# EAGLE design 2channelrelaydriver_throughole (EAGLE 7.2.0)
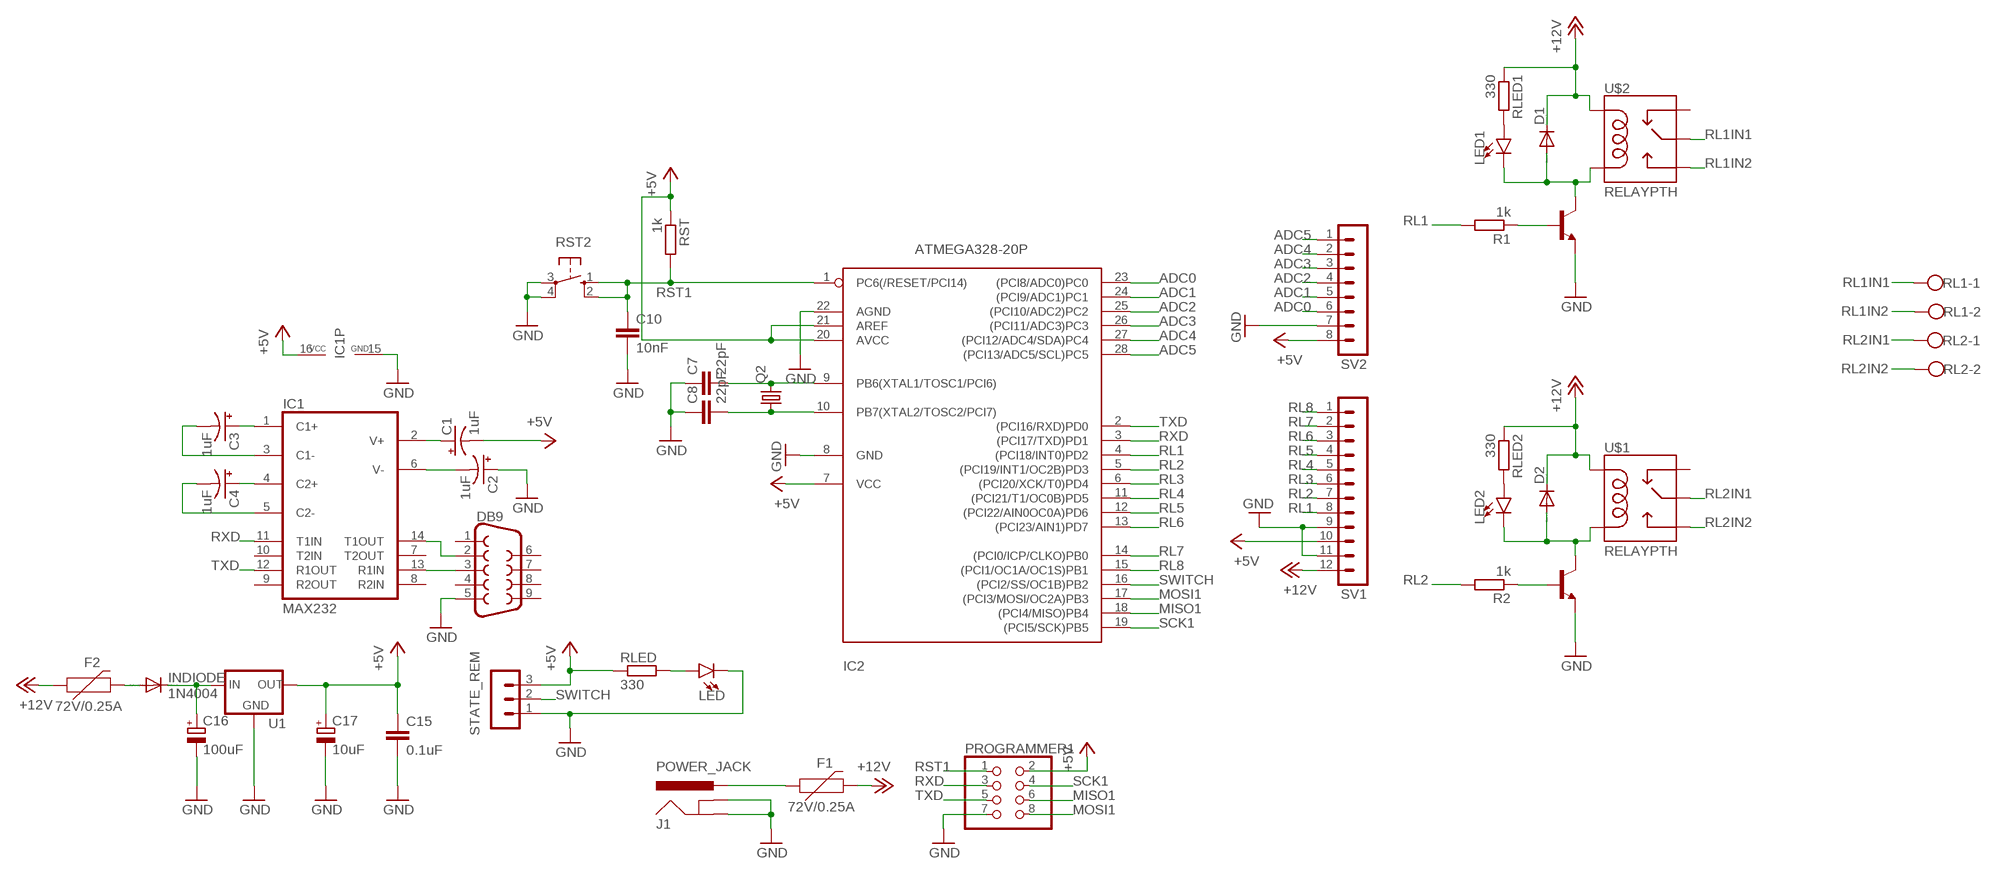
[diagram p0: schematic, sheet 1]

## Parts
C1  1uF  CPOL-USE2.5-6  [E2,5-6]
C2  1uF  CPOL-USE2.5-6  [E2,5-6]
C3  1uF  CPOL-USE2.5-6  [E2,5-6]
C4  1uF  CPOL-USE2.5-6  [E2,5-6]
C7  22pF  C-EU025-025X050  [C025-025X050]
C8  22pF  C-EU025-025X050  [C025-025X050]
C10  10nF  C-EU050-025X075  [C050-025X075]
C15  0.1uF  C-EU050-025X075  [C050-025X075]
C16  100uF  CPOL-EUE2.5-6  [E2,5-6]
C17  10uF  CPOL-EUE2.5-6  [E2,5-6]
D1  1N4004  [DO41-10]
D2  1N4004  [DO41-10]
DB9  DB9FEMALE  [DB9]
F1  72V/0.25A  PPTC_PTH  [PTH]
F2  72V/0.25A  PPTC_PTH  [PTH]
IC1  MAX232  [DIL16]
IC2  ATMEGA328-20P  [DIL28-3]
INDIODE  1N4004  [DO41-10]
J1  POWER_JACK  [POWER_JACK_PTH]
LED  LED5MM  [LED_5MM]
LED1  LED5MM  [LED_5MM]
LED2  LED5MM  [LED_5MM]
PROGRAMMER1  PINHD-2X4  [2X04]
Q2  CRYSTALHC49U70  [HC49U70]
R1  1k  R-EU_0207/10  [0207/10]
R2  1k  R-EU_0207/10  [0207/10]
RL1  W237-102  [W237-102]
RL2  W237-102  [W237-102]
RLED  330  R-EU_0207/10  [0207/10]
RLED1  330  R-EU_0207/10  [0207/10]
RLED2  330  R-EU_0207/10  [0207/10]
RST  1k  R-EU_0207/10  [0207/10]
RST2  10-XX  [B3F-10XX]
STATE_REM  MA03-1  [MA03-1]
SV1  MA12-1  [MA12-1]
SV2  MA08-1  [MA08-1]
T1  BC547  [TO92]
T2  BC547  [TO92]
U1  V_REG_78XXSIDE  [78XXL]
U$1  RELAYPTH  [SRD-05VDC-SL-C]
U$2  RELAYPTH  [SRD-05VDC-SL-C]

## Nets
+12V: D1.C D2.C F1.P$2 F2.P$1 RLED1.1 RLED2.1 SV1.12 U$1.COIL1 U$2.COIL1
ADC0: IC2.23((PCI8/ADC0)PC0) SV2.6
ADC1: IC2.24((PCI9/ADC1)PC1) SV2.5
ADC2: IC2.25((PCI10/ADC2)PC2) SV2.4
ADC3: IC2.26((PCI11/ADC3)PC3) SV2.3
ADC4: IC2.27((PCI12/ADC4/SDA)PC4) SV2.2
ADC5: IC2.28((PCI13/ADC5/SCL)PC5) SV2.1
MISO1: IC2.18((PCI4/MISO)PB4) PROGRAMMER1.6
MOSI1: IC2.17((PCI3/MOSI/OC2A)PB3) PROGRAMMER1.8
N$1: DB9.2 IC1.14(T1OUT)
N$2: LED.A RLED.2
N$3: C16.+ INDIODE.C U1.IN
N$4: D2.A LED2.K(C) T2.3(C) U$1.COIL0
N$5: D1.A LED1.K(C) T1.3(C) U$2.COIL0
N$6: R1.1 T1.2(B)
N$7: R2.1 T2.2(B)
N$8: F1.P$1 J1.PWR
N$9: LED1.A RLED1.2
N$10: LED2.A RLED2.2
N$11: F2.P$2 INDIODE.A
N$18: C1.+ IC1.2(V+)
N$20: C2.- IC1.6(V-)
N$21: C7.2 IC2.9(PB6(XTAL1/TOSC1/PCI6)) Q2.2
N$22: C8.2 IC2.10(PB7(XTAL2/TOSC2/PCI7)) Q2.1
N$23: C3.+ IC1.1(C1+)
N$24: C4.+ IC1.4(C2+)
N$25: C4.- IC1.5(C2-)
N$26: C3.- IC1.3(C1-)
PIN13: DB9.3 IC1.13(R1IN)
RL1: IC2.4((PCI18/INT0)PD2) R1.2 SV1.8
RL1IN1: RL1.1 U$2.SWCOMMON
RL1IN2: RL1.2 U$2.SWOPEN
RL2: IC2.5((PCI19/INT1/OC2B)PD3) R2.2 SV1.7
RL2IN1: RL2.1 U$1.SWCOMMON
RL2IN2: RL2.2 U$1.SWOPEN
RL3: IC2.6((PCI20/XCK/T0)PD4) SV1.6
RL4: IC2.11((PCI21/T1/OC0B)PD5) SV1.5
RL5: IC2.12((PCI22/AIN0OC0A)PD6) SV1.4
RL6: IC2.13((PCI23/AIN1)PD7) SV1.3
RL7: IC2.14((PCI0/ICP/CLKO)PB0) SV1.2
RL8: IC2.15((PCI1/OC1A/OC1S)PB1) SV1.1
RST1: C10.1 IC2.1(PC6(/RESET/PCI14)) PROGRAMMER1.1 RST2.1(S) RST2.2(S1) RST.2
RXD: IC1.11(T1IN) IC2.3((PCI17/TXD)PD1) PROGRAMMER1.3
SCK1: IC2.19((PCI5/SCK)PB5) PROGRAMMER1.4
SWITCH: IC2.16((PCI2/SS/OC1B)PB2) STATE_REM.2
TXD: IC1.12(R1OUT) IC2.2((PCI16/RXD)PD0) PROGRAMMER1.5
VDD: C1.- C15.1 C17.+ IC1.16(VCC) IC2.7(VCC) IC2.20(AVCC) IC2.21(AREF) PROGRAMMER1.2 RLED.1 RST.1 STATE_REM.3 SV1.10 SV2.8 U1.OUT ; supply symbol labelled +5V
VSS: C2.+ C7.1 C8.1 C10.2 C15.2 C16.- C17.- DB9.5 IC1.15(GND) IC2.8(GND) IC2.22(AGND) J1.GND J1.GNDBREAK LED.K(C) PROGRAMMER1.7 RST2.3(P) RST2.4(P1) STATE_REM.1 SV1.9 SV1.11 SV2.7 T1.1(E) T2.1(E) U1.GND ; supply symbol labelled GND
Unconnected: DB9.1 DB9.4 DB9.6 DB9.7 DB9.8 DB9.9 IC1.7(T2OUT) IC1.8(R2IN) IC1.9(R2OUT) IC1.10(T2IN) U$1.SWCLOSED(SWCLOSE) U$2.SWCLOSED(SWCLOSE)

## Library data of the parts
C1-C4 = rcl:CPOL-US: POLARIZED CAPACITOR, American symbol
C7 C8 C10 C15 = rcl:C-EU: CAPACITOR, European symbol
C16 C17 = rcl:CPOL-EU: POLARIZED CAPACITOR, European symbol
D1 D2 INDIODE = diode:1N4004: DIODE general purpose rectifier, 1 A
DB9 = SparkFun-Connectors:DB9: DB9 Connector Standard DB9 (D-Sub 9) serial connector. Can be used for CAN bus as well as RS485 and RS232. Footprint production proven. Here is the female version connector we sell at SparkFun: 9 Pin Female Serial Connector - PCB Mount <https://www.sparkfun.com/products/429> (PRT-00429) This connector has been used on the following SparkFun products: SparkFun RS232 Shifter - SMD <https://www.sparkfun.com/products/449> (PRT-00449) SparkFun RS232 Shifter SMD (No DB9) <https://www.sparkfun.com/products/8780> (PRT-08780); PROD_ID: CONN-08194
F1 F2 = SparkFun-Fuses:PPTC: Resettable Fuse PPTC Resettable Fuse. Really a sort of resistor with a polymeric positive temperature coefficient whose resistance increases dramatically with an increase in temperature. When heated by the power passing through the resistance rises causing the current to be limited, protecting the circuit. This is achieved by the transition of the polymer from a crystalline to an amorphous state where the conductive carbon separates breaking the conductive pathways found in the cool crystalline structure. When a PPTC cools back down it resumes conducting letting the circuit turn back on. SparkFun Products: SparkFun RedBoard - Programmed with Arduino <https://www.sparkfun.com/products/12757> Pro Micro - 5V/16MHz <https://www.sparkfun.com/products/12640> Arduino Pro 328 - 5V/16MHz <https://www.sparkfun.com/products/10915> MP3 Trigger <https://www.sparkfun.com/products/13720>; PROD_ID: RES-08490
IC1 = maxim:MAX232: RS232 TRANSCEIVER; MF: MAXIM; MPN: MAX232ACPE+; OC_FARNELL: 9723773; OC_NEWARK: 68K4544
IC2 = atmega328:ATMEGA328*P: MICROCONTROLLER 32 kBytes FLASH 2 kBytes SRAM 1 kBytes EEPROM USART 8-channel 10 bit ADC
J1 = SparkFun-Connectors:POWER_JACK: Power Jack Connector This is the standard 5.5mm barrel jack for power. The PTH is the most common, proven, reliable, footprint. The Slot footprint only works if the mill layer is transmitted to the PCB fab house so be warned. Here are the connectors we sell at SparkFun: DC Barrel Power Jack/Connector <https://www.sparkfun.com/products/119> (PRT-00119) DC Barrel Power Jack/Connector (SMD) <https://www.sparkfun.com/products/12748> (PRT-12748) DC Barrel Jack Adapter - Breadboard Compatible <https://www.sparkfun.com/products/10811> (PRT-10811) It is used on this SparkFun product (and many, many others): SparkFun RedBoard - Programmed with Arduino <https://www.sparkfun.com/products/12757> (DEV-12757) Also, if you need a mating power supply or connector, please check these out: Wall Adapter Power Supply - 9VDC 650mA <https://www.sparkfun.com/products/298> (TOL-00298) DC Barrel Jack Adapter - Male <https://www.sparkfun.com/products/10287> (PRT-10287); PROD_ID: CONN-08197
LED LED1 LED2 = SparkFun-LED:LED: LED (Generic) Standard schematic elements and footprints for 5mm, 3mm, 1206, and 0603 sized LEDs. Generic LEDs with no color specified.
PROGRAMMER1 = pinhead:PINHD-2X4: PIN HEADER
Q2 = crystal:CRYSTAL: CRYSTAL; OC_FARNELL: unknown; OC_NEWARK: unknown
R1 R2 RLED RLED1 RLED2 RST = resistor:R-EU_: RESISTOR, European symbol
RL1 RL2 = con-wago-500:W237-102: WAGO SCREW CLAMP; MPN: 237-102; OC_FARNELL: unknown; OC_NEWARK: 70K9898
RST2 = switch-omron:10-XX: OMRON SWITCH; MPN: B3F-1000; OC_FARNELL: 176432; OC_NEWARK: 36M3542
STATE_REM = con-lstb:MA03-1: PIN HEADER; OC_FARNELL: unknown; OC_NEWARK: unknown
SV1 = con-lstb:MA12-1: PIN HEADER; OC_FARNELL: unknown; OC_NEWARK: unknown
SV2 = con-lstb:MA08-1: PIN HEADER; OC_FARNELL: unknown; OC_NEWARK: unknown
T1 T2 = transistor-neu-to92:BC547: NPN TRANSISTOR
U1 = SparkFun-IC-Power:V_REG_78XX: Voltage Regulator Standard 78xx regulator. IGO (Input Ground Output). Spark Fun Electronics SKU : COM-00107
U$1 U$2 = SRD-05VDC-SL-C:RELAY: SPDT relay (COM-00101)

## Board
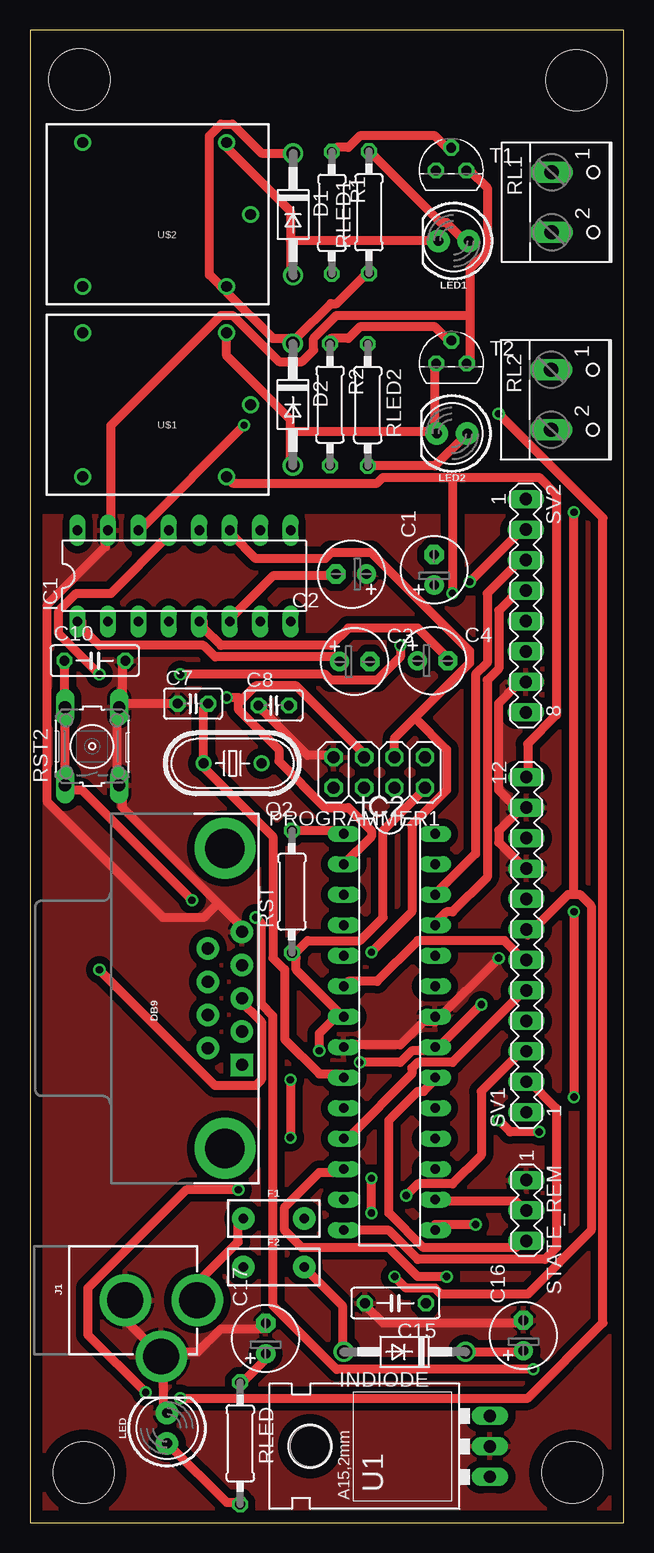
[diagram p1: board, top side]
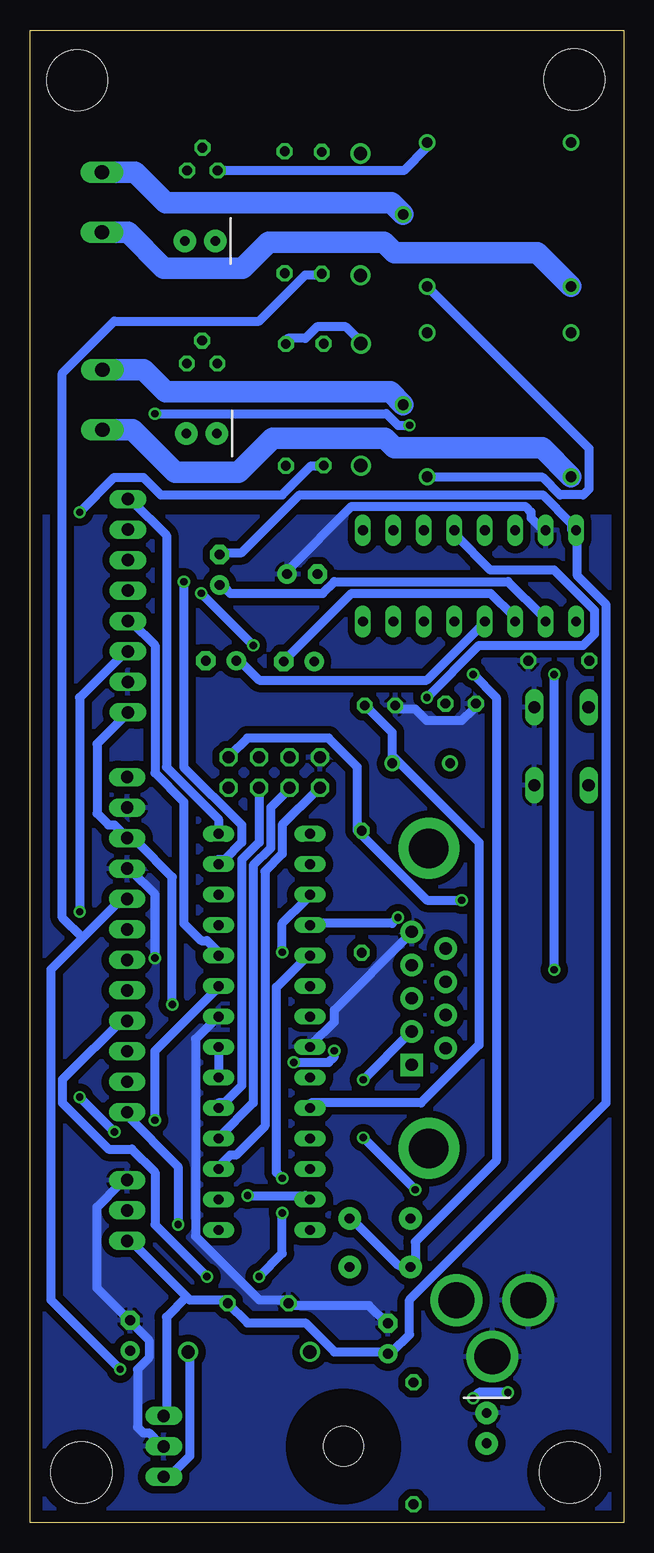
[diagram p2: board, bottom side, seen from below]

Size 49.51 x 124.38 mm. Coordinates in mm from the lower left corner, seen from the top.
Outline: 0,0 49.51,0 49.51,124.38 0,124.38 0,0
Copper layers (1*16): Top 0.035mm / dielectric 1.5mm / Bottom 0.035mm
Design rules "default *": minimum track width 30mil, minimum drill 24mil, track to track 8mil, track to pad 8mil, pad to pad 8mil, via to via 8mil, smd to smd 8mil, copper to edge 40mil, drill to drill 8mil, minimum pad ring 10mil, minimum via ring 8mil, stop-mask expansion 4mil, vias tented up to drill 0mil, thermal gap 10mil
Holes 5.08 mm at 4.12,120.25 45.57,120.2 45.22,4.18 4.48,4.18

### Footprints (pad centres in the part's own frame; a part is rotated, then mirrored left to right if it is on the bottom)
E2,5-6 = drill 0.813 pad 1.6: + -1.27,0 | drill 0.813 pad 1.6 octagon: - 1.27,0
C025-025X050 = drill 0.813 octagon: 1 -1.27,0; 2 1.27,0
C050-025X075 = drill 0.813 octagon: 1 -2.54,0; 2 2.54,0
DO41-10 = drill 1.118: A 5.08,0; C -5.08,0
DB9 = drill 1.016 pad 1.88 square: 1 -5.54,-1.42 | drill 1.016 pad 1.88: 2 -2.77,-1.42; 3 0,-1.42; 4 2.77,-1.42; 5 5.54,-1.42; 6 -4.15,1.42; 7 -1.38,1.42; 8 1.38,1.42; 9 4.15,1.42 | drill 3.302 pad 5.08: G1 -12.5,0; G2 12.5,0
PTH = drill 0.8 pad 1.88: P$1 -2.54,0; P$2 2.54,0
DIL16 = drill 0.813 long: 1 -8.89,-3.81; 2 -6.35,-3.81; 3 -3.81,-3.81; 4 -1.27,-3.81; 5 1.27,-3.81; 6 3.81,-3.81; 7 6.35,-3.81; 8 8.89,-3.81; 9 8.89,3.81; 10 6.35,3.81; 11 3.81,3.81; 12 1.27,3.81; 13 -1.27,3.81; 14 -3.81,3.81; 15 -6.35,3.81; 16 -8.89,3.81
DIL28-3 = drill 0.813 long: 1 -16.51,-3.81; 2 -13.97,-3.81; 3 -11.43,-3.81; 4 -8.89,-3.81; 5 -6.35,-3.81; 6 -3.81,-3.81; 7 -1.27,-3.81; 8 1.27,-3.81; 9 3.81,-3.81; 10 6.35,-3.81; 11 8.89,-3.81; 12 11.43,-3.81; 13 13.97,-3.81; 14 16.51,-3.81; 15 16.51,3.81; 16 13.97,3.81; 17 11.43,3.81; 18 8.89,3.81; 19 6.35,3.81; 20 3.81,3.81; 21 1.27,3.81; 22 -1.27,3.81; 23 -3.81,3.81; 24 -6.35,3.81; 25 -8.89,3.81; 26 -11.43,3.81; 27 -13.97,3.81; 28 -16.51,3.81
POWER_JACK_PTH = drill 2.997 pad 4.318: GND 0,7.7; GNDBREAK 4.7,10.7; PWR 0,13.7
LED_5MM = drill 0.813 pad 1.88: A -1.27,0; K 1.27,0
2X04 = drill 1.016 octagon: 1 -3.81,-1.27; 2 -3.81,1.27; 3 -1.27,-1.27; 4 -1.27,1.27; 5 1.27,-1.27; 6 1.27,1.27; 7 3.81,-1.27; 8 3.81,1.27
HC49U70 = drill 0.813: 1 -2.413,0; 2 2.413,0
0207/10 = drill 0.813 octagon: 1 -5.08,0; 2 5.08,0
W237-102 = drill 1.194 long: 1 -2.5,-1.27; 2 2.5,-1.27
B3F-10XX = drill 1.016 long: 1 -3.251,2.261; 2 3.251,2.261; 3 -3.251,-2.261; 4 3.251,-2.261
MA03-1 = drill 1.016 long: 1 -2.54,0; 2 0,0; 3 2.54,0
MA12-1 = drill 1.016 long: 1 -13.97,0; 2 -11.43,0; 3 -8.89,0; 4 -6.35,0; 5 -3.81,0; 6 -1.27,0; 7 1.27,0; 8 3.81,0; 9 6.35,0; 10 8.89,0; 11 11.43,0; 12 13.97,0
MA08-1 = drill 1.016 long: 1 -8.89,0; 2 -6.35,0; 3 -3.81,0; 4 -1.27,0; 5 1.27,0; 6 3.81,0; 7 6.35,0; 8 8.89,0
TO92 = drill 0.813 octagon: 1 1.27,0; 2 0,1.905; 3 -1.27,0
78XXL = drill 1.016 long: GND 0,-3.81; IN -2.54,-3.81; OUT 2.54,-3.81 | hole 3.302: 0,11.176
SRD-05VDC-SL-C = drill 0.9: COIL0 -5.39,-6.12; COIL1 -5.39,5.88; SWCLOSED 6.61,-6.12; SWCOMMON -7.39,-0.12; SWOPEN 6.61,5.88

### Placement (x,y rotation side)
C1  33.71,79.4 90 top
C2  26.8,79.04 180 top
C3  27.08,71.75 0 top
C4  33.58,71.83 0 top
C7  13.59,68.25 0 top
C8  20.32,68.1 0 top
C10  5.41,71.83 0 top
C15  30.48,18.29 180 top
C16  41.15,15.6 90 top
C17  19.66,15.34 90 top
D1  21.95,109.02 270 top
D2  21.92,93.17 270 top
DB9  16.26,43.69 90 top
F1  20.32,25.35 0 top
F2  20.32,21.29 0 top
IC1  12.85,78.89 0 top
IC2  29.97,40.89 270 top
INDIODE  31.24,14.22 180 top
J1  0.25,18.54 270 top
LED  11.43,7.87 90 top
LED1  35.33,106.81 180 top
LED2  35.2,90.75 180 top
PROGRAMMER1  29.13,62.51 180 top
Q2  16.89,63.27 180 top
R1  25.17,109.14 270 top
R2  25.02,93.17 270 top
RL1  44.78,110.03 270 top
RL2  44.73,93.57 270 top
RLED  17.53,6.6 270 top
RLED1  28.27,109.19 90 top
RLED2  28.17,93.14 270 top
RST  21.84,52.58 90 top
RST2  5.18,64.69 90 top
STATE_REM  41.4,26.01 270 top
SV1  41.4,48.16 90 top
SV2  41.35,76.4 270 top
T1  35.13,112.67 0 top
T2  35.15,96.6 0 top
U1  34.54,6.35 90 top
U$1  11,93.04 180 top
U$2  11,108.89 180 top

### Tracks (layer width: path | path; a pad name or v marks a point on that pad's centre or on a via)
+12V  (via drill 0.61)
  Top 0.762: RLED1.1 27.99,103.99 25.58,101.58 25.09,101.58 22.2,98.68 D2.C 21.72,98.68 20.27,98.68 16.41,102.54 U$2.COIL1 15.93,103.02 14.96,103.99 14.96,115.57 15.93,116.53 16.89,116.53 19.3,114.12 21.72,114.12 D1.C | 35.23,87.1 29.44,87.1 28.96,86.61 16.89,86.61 16.41,87.1 U$1.COIL1 | 35.23,87.1 42.47,87.1 43.92,85.65 43.92,67.31 41.5,64.9 41.5,62.48 SV1.12 | v12.55,70.69 24.61,70.69 25.09,70.21 28.96,70.21 30.89,72.14 v30.89,73.1 | 35.23,87.1 v35.23,77.45
  Bottom 0.762: RLED2.1 27.99,98.68 26.54,98.68 25.58,99.64 23.16,99.64 22.2,98.68 D2.C | F1.P$2 22.68,25.32 18.82,21.46 17.86,21.46 F2.P$1 17.37,21.46 17.37,23.39 10.62,30.15 10.62,68.76 v12.55,70.69 | U$1.COIL1 15.93,87.1 6.76,87.1 5.31,85.65 3.38,85.65 2.9,86.13 2.9,89.51 15.93,102.54 U$2.COIL1 | v35.23,77.45 v30.89,73.1
ADC0  (via drill 0.61)
  Top 0.762: v39.09,33.53 40.06,32.56 v42.47,32.56 | v45.36,50.9 v45.36,35.46
  Bottom 0.762: v39.09,33.53 39.09,39.32 33.78,44.63 IC2.23 | v45.36,35.46 v42.47,32.56 | v45.36,50.9 45.36,68.76 41.5,72.62 SV2.6
ADC1
  Bottom 0.762: IC2.24 33.78,47.52 34.75,48.49 35.23,48.49 36.68,49.94 36.68,60.07 39.09,62.48 39.09,73.1 41.02,75.03 SV2.5
ADC2
  Top 0.762: IC2.25 33.78,49.94 34.75,50.9 35.23,50.9 38.12,53.8 38.12,70.21 39.09,71.17 39.09,76 41.02,77.93 SV2.4
ADC3
  Top 0.762: IC2.26 33.78,52.35 37.16,55.73 37.16,70.69 38.12,71.65 38.12,77.45 41.02,80.34 SV2.3
ADC4  (via drill 0.61)
  Top 0.762: v36.68,78.41 41.02,82.75 SV2.2
  Bottom 0.762: v36.68,78.41 36.68,62.97 31.85,58.14 31.85,56.69 33.3,55.25 33.78,55.25 IC2.27
ADC5
  Bottom 0.762: IC2.28 33.78,58.62 38.12,62.97 38.12,82.27 41.02,85.17 SV2.1
MISO1
  Bottom 0.762: IC2.18 33.78,32.08 30.89,34.98 30.89,54.76 29.44,56.21 29.44,59.59 27.99,61.04 PROGRAMMER1.6
MOSI1
  Bottom 0.762: IC2.17 33.78,29.67 32.82,30.63 32.33,30.63 29.92,33.05 29.92,54.28 28.47,55.73 28.47,58.14 25.58,61.04 PROGRAMMER1.8
N$1  (via drill 0.61)
  Top 0.762: v17.86,91.44 9.17,82.75 IC1.14 | v39.09,92.41 47.78,83.72 47.78,16.64 41.5,10.36 v12.55,10.36 | v9.65,10.85 4.83,15.67 4.83,19.53 13.03,27.74 v17.37,27.74 | v21.72,36.91 v21.72,32.08
  Bottom 0.762: v17.86,91.44 18.82,91.44 19.79,92.41 v39.09,92.41 | v12.55,10.36 12.06,10.85 v9.65,10.85 | v21.72,32.08 v17.37,27.74 | v21.72,36.91 17.86,40.77 DB9.2
N$2
  Top 0.762: RLED.2 17.37,1.68 16.41,1.68 11.58,6.5 LED.A
N$3
  Top 0.762: INDIODE.C 41.02,14.22 C16.+
  Bottom 0.762: U1.IN 38.12,4.09 37.64,4.09 36.2,5.54 36.2,14.22 INDIODE.C
N$4
  Top 0.762: 33.78,90.96 33.78,96.27 T2.3 | 21.72,90.96 21.72,88.54 D2.A | 21.72,90.96 21.72,91.92 16.41,97.23 16.41,98.68 U$1.COIL0 | 21.72,90.96 33.78,90.96 | 33.78,90.96 LED2.K
N$5
  Top 0.762: 21.72,106.88 21.72,109.3 16.41,114.61 U$2.COIL0 | 21.72,106.88 21.72,103.99 D1.A | 21.72,106.88 33.78,106.88 LED1.K
  Bottom 0.762: T1.3 18.34,112.67 16.41,114.61 U$2.COIL0
N$6
  Top 0.762: R1.1 25.58,114.61 26.54,114.61 27.51,115.57 33.78,115.57 34.75,114.61 T1.2
N$7
  Top 0.762: R2.1 25.09,98.68 26.54,98.68 27.51,99.64 33.78,99.64 34.75,98.68 T2.2
N$8
  Top 0.762: F1.P$1 17.37,25.32 17.37,23.39 13.99,20.02 13.99,18.57 J1.PWR
N$9
  Top 0.762: RLED1.2 28.47,114.12 34.27,108.33 34.75,108.33 36.2,106.88 LED1.A
N$10
  Top 0.762: RLED2.2 33.78,88.06 LED2.A
N$11
  Top 0.762: F2.P$2 26.06,18.09 26.06,14.22 INDIODE.A
N$18
  Bottom 0.762: IC1.2 6.76,75.51 9.65,78.41 24.13,78.41 25.09,77.45 32.82,77.45 33.3,77.93 C1.+
N$20
  Top 0.762: IC1.6 16.89,75.51 20.27,78.89 25.09,78.89 C2.-
N$21
  Top 0.762: IC2.9 26.06,37.39 24.13,37.39 21.23,40.28 21.23,46.08 20.27,47.04 20.27,57.17 14.48,62.97 Q2.2 14.48,67.79 C7.2
N$22
  Bottom 0.762: 19.3,63.93 19.3,65.86 21.23,67.79 C8.2 | 19.3,63.93 Q2.1 | 19.3,63.93 12.06,56.69 12.06,39.8 16.89,34.98 26.06,34.98 IC2.10
N$23
  Top 0.762: IC1.1 4.34,75.03 4.34,74.55 5.79,73.1 14.48,73.1 15.44,72.14 25.58,72.14 C3.+
N$24
  Bottom 0.762: IC1.4 11.58,75.03 16.41,70.21 30.4,70.21 31.85,71.65 C4.+
N$25
  Top 0.762: IC1.5 14.48,75.03 14.48,74.55 15.93,73.1 25.09,73.1 26.54,74.55 32.33,74.55 34.75,72.14 C4.-
N$26
  Bottom 0.762: IC1.3 9.17,75.51 11.1,77.45 22.68,77.45 27.99,72.14 C3.-
PIN13  (via drill 0.61)
  Top 0.762: v5.79,70.69 2.41,74.07 2.41,76 3.86,77.45 6.76,77.45 11.58,82.27 IC1.13 | v5.79,46.08 15.44,36.42 18.82,36.42 19.3,36.91 19.3,41.73 17.37,43.66 DB9.3
  Bottom 0.762: v5.79,46.08 v5.79,70.69
RL1  (via drill 0.61)
  Top 0.762: v18.82,50.42 19.3,49.94 19.3,43.18 20.27,42.22 20.27,18.09 25.58,12.78 v41.99,12.78
  Bottom 0.762: v18.82,50.42 19.3,49.94 26.06,49.94 IC2.4 | v41.99,12.78 47.78,18.57 47.78,46.08 45.12,48.73 | 45.12,48.73 41.5,52.35 SV1.8 | 45.12,48.73 46.81,50.42 46.81,95.78 42.47,100.13 30.4,100.13 26.54,103.99 25.58,103.99 R1.2
RL1IN1
  Bottom 1.778: RL1.1 40.75,112.53 38.2,109.98 19.36,109.98 U$2.SWCOMMON
RL1IN2
  Bottom 1.778: RL1.2 41.34,107.53 38.35,104.55 31.77,104.55 29.62,106.7 19.99,106.7 19.1,105.82 7.2,105.82 U$2.SWOPEN
RL2  (via drill 0.61)
  Top 0.762: v28.47,25.81 v28.47,28.7 | v30.4,20.5 31.37,19.53 33.78,19.53 34.27,19.05 41.5,19.05 46.81,24.36 46.81,51.38 45.85,52.35 45.36,52.35 | 45.36,52.35 44.88,52.35 41.5,48.97 SV1.7 | 45.36,52.35 v45.36,84.2
  Bottom 0.762: 24.92,87.95 R2.2 25.09,88.06 26.06,88.06 28.47,85.65 38.61,85.65 40.06,87.1 42.47,87.1 v45.36,84.2 | v28.47,28.7 28.96,29.19 28.96,44.63 26.54,47.04 IC2.5 | v28.47,25.81 28.47,22.43 v30.4,20.5
RL2IN1
  Bottom 1.778: RL2.1 40.04,96.07 38.2,94.23 19.46,94.23 U$1.SWCOMMON
RL2IN2
  Bottom 1.778: RL2.2 40.93,91.07 37.39,87.53 32.11,87.53 29.26,90.37 19.91,90.37 19.1,89.56 6.79,89.56 U$1.SWOPEN
RL3
  Top 0.762: IC2.6 26.54,45.11 28.96,45.11 32.33,48.49 39.57,48.49 41.02,47.04 SV1.6
RL4
  Top 0.762: IC2.11 26.54,32.08 31.85,37.39 31.85,37.87 32.33,38.35 35.23,38.35 41.02,44.14 SV1.5
RL5  (via drill 0.61)
  Top 0.762: v34.75,20.5 32.33,20.5 29.92,22.91 22.68,22.91 21.23,24.36 21.23,26.29 24.13,29.19 26.06,29.19 IC2.12
  Bottom 0.762: v34.75,20.5 39.09,24.84 39.09,29.19 41.02,31.12 42.95,31.12 46.81,34.98 46.81,36.91 41.5,42.22 SV1.4
RL6  (via drill 0.61)
  Top 0.762: v31.37,27.25 32.33,28.22 35.23,28.22 37.64,30.63 37.64,35.94 41.02,39.32 SV1.3
  Bottom 0.762: v31.37,27.25 26.54,27.25 IC2.13
RL7
  Top 0.762: IC2.14 26.54,24.36 29.92,24.36 32.33,21.95 42.95,21.95 43.92,22.91 43.92,34.49 41.5,36.91 SV1.2
RL8  (via drill 0.61)
  Top 0.762: v37.16,24.84 33.78,24.84 IC2.15
  Bottom 0.762: v37.16,24.84 37.16,29.67 41.5,34.01 SV1.1
RST1  (via drill 0.61)
  Top 0.762: C10.1 2.9,71.65 2.9,68.28 RST2.2 2.9,67.79 2.9,61.52 RST2.1 3.38,61.04 4.34,61.04 v13.51,51.87 | RST.2 26.06,57.66 IC2.1
  Bottom 0.762: 22.2,57.66 22.2,62.97 24.61,65.38 31.37,65.38 32.82,63.93 PROGRAMMER1.1 | v13.51,51.87 16.41,51.87 22.2,57.66 | 22.2,57.66 RST.2
RXD  (via drill 0.61)
  Top 0.762: 32.09,67.07 30.4,65.38 PROGRAMMER1.3 | 32.09,67.07 36.68,71.65 36.68,72.62 28.47,80.82 25.09,80.82 24.61,80.34 18.82,80.34 16.89,82.27 IC1.11 | v28.47,47.52 31.85,50.9 31.85,58.14 34.75,61.04 34.75,64.41 32.09,67.07
  Bottom 0.762: v28.47,47.52 28.47,49.94 26.54,51.87 IC2.3
SCK1
  Bottom 0.762: PROGRAMMER1.4 30.4,56.69 31.85,55.25 31.85,36.42 33.3,34.98 33.78,34.98 IC2.19
SWITCH
  Top 0.762: IC2.16 33.78,26.77 40.54,26.77 41.02,26.29 STATE_REM.2
TXD  (via drill 0.61)
  Top 0.762: IC2.2 28.47,57.17 28.47,57.66 26.54,59.59 24.61,59.59 20.75,63.45 20.75,64.41 17.37,67.79 17.37,68.28 17.61,68.52 | 17.61,68.52 18.82,69.72 22.2,69.72 27.99,63.93 PROGRAMMER1.5 | v16.41,68.76 17.37,68.76 17.61,68.52
  Bottom 0.762: v16.41,68.76 12.06,73.1 3.38,73.1 2.41,74.07 2.41,76 5.79,79.38 11.1,79.38 13.99,82.27 IC1.12
VDD  (via drill 0.61)
  Top 0.762: PROGRAMMER1.2 32.82,61.04 29.44,57.66 29.44,50.42 27.51,48.49 23.16,48.49 22.2,47.52 RST.1 22.2,47.04 22.2,46.08 26.06,42.22 IC2.7 25.58,42.22 24.13,40.77 v24.13,39.32 | RLED.1 17.86,11.81 19.79,13.74 C17.+ | IC2.20 33.78,36.91 32.82,35.94 32.33,35.94 29.92,33.53 29.92,25.81 32.82,22.91 40.54,22.91 41.02,23.39 STATE_REM.3 | 33.78,39.32 v37.64,43.18 | v27.51,38.35 30.89,38.35 31.85,39.32 33.78,39.32 | 33.78,39.32 IC2.21
  Bottom 0.762: C1.- 33.3,80.82 31.85,80.82 27.03,85.65 6.76,85.65 4.34,83.24 4.34,82.75 IC1.16 3.86,82.27 3.86,78.89 1.45,76.48 1.45,34.98 17.86,18.57 17.86,15.67 19.3,14.22 C17.+ 19.79,14.22 24.13,14.22 26.54,16.64 31.37,16.64 C15.1 33.3,18.57 36.2,18.57 36.44,18.81 | SV2.8 41.5,67.31 43.92,64.9 43.92,59.11 42.95,58.14 42.47,58.14 41.5,57.17 SV1.10 41.02,56.69 40.54,56.69 37.64,53.8 v37.64,43.18 | IC2.21 IC2.20 | 36.44,18.81 41.02,23.39 STATE_REM.3 | 36.44,18.81 38.12,17.12 38.12,8.92 U1.OUT | v24.13,39.32 24.13,38.84 24.61,38.35 v27.51,38.35
VSS  (via drill 0.61)
  Top 0.762: 36.68,100.61 36.68,104.47 38.12,105.92 38.12,111.23 36.68,112.67 T1.1 | 36.68,100.61 36.68,96.75 T2.1 | 36.68,100.61 25.58,100.61 23.65,98.68 23.65,97.71 22.68,96.75 20.75,96.75 16.89,100.61 15.93,100.61 6.76,91.44 6.76,82.75 IC1.15 6.27,82.27 6.27,81.31 1.45,76.48 1.45,60.07 11.1,50.42 14.48,50.42 15.68,51.62 | LED.K 11.1,9.4 11.1,13.74 J1.GNDBREAK | C17.- 19.3,16.15 15.93,16.15 13.99,14.22 11.1,14.22 J1.GNDBREAK | J1.GND 8.2,18.09 8.2,16.64 10.62,14.22 J1.GNDBREAK | C16.- 41.02,16.64 29.44,16.64 27.99,18.09 C15.2 | C8.1 19.3,67.79 23.16,63.93 25.09,63.93 PROGRAMMER1.7 | 7.72,68.28 7.72,71.65 C10.2 | 7.72,68.28 12.06,68.28 C7.1 | 7.72,68.28 RST2.4 7.24,67.79 7.24,61.52 RST2.3 7.72,61.04 7.72,59.59 15.68,51.62 | SV1.9 41.02,54.76 39.09,56.69 39.09,57.66 41.02,59.59 SV1.11 40.54,59.59 39.09,61.04 39.09,68.28 40.54,69.72 41.02,69.72 SV2.7 | 33.78,41.73 32.82,41.73 30.89,39.8 26.54,39.8 IC2.8 | 33.78,41.73 v39.09,47.04 | 33.78,41.73 IC2.22 | 15.68,51.62 17.86,49.45 DB9.5
  Bottom 0.762: IC1.15 6.76,82.75 7.72,83.72 7.72,84.2 8.2,84.68 22.68,84.68 27.99,79.38 C2.+ | U1.GND 38.61,6.5 39.57,7.47 40.06,7.47 40.54,7.95 40.54,12.78 39.57,13.74 39.57,15.19 41.02,16.64 C16.- 41.5,17.12 43.92,19.53 43.92,26.29 41.99,28.22 41.5,28.22 STATE_REM.1 | C17.- 19.79,16.64 21.23,18.09 27.51,18.09 C15.2 27.99,18.57 30.4,18.57 35.71,23.88 35.71,40.28 33.78,42.22 IC2.22 | C8.1 18.82,67.79 17.37,67.79 16.41,66.83 13.51,66.83 12.55,67.79 C7.1 | DB9.5 17.86,48.97 24.13,42.7 24.13,41.73 26.06,39.8 IC2.8 | v39.09,47.04 39.09,52.35 41.02,54.28 SV1.9
  pour Top (isolate 0.61): 0,83.82 0,0 49.53,0 49.53,83.82
  pour Bottom (isolate 0.61): 0,83.82 0,0 49.53,0 49.53,83.82